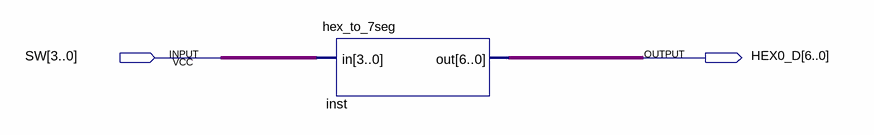
[diagram p0: schematic sheet]
// Quartus schematic veri_decoder.bdf as structural Verilog: 1 symbols, 2 pins
module veri_decoder (
  input  [3:0] SW,
  output [6:0] HEX0_D
);

  hex_to_7seg inst (.in(SW), .out(HEX0_D));
endmodule
